# Altium schematic sheet MAZ000173 - Diagrama físico.SchDoc: MAZ000173 - Diagrama físico
size A; ApprovedBy: Christian Ledwidth; CheckedBy: Nahuel Martinez; Author: Santiago Marti; CompanyName: Body Health; DrawnBy: Santiago Marti; Revision: A; SheetNumber: 1; SheetTotal: 2
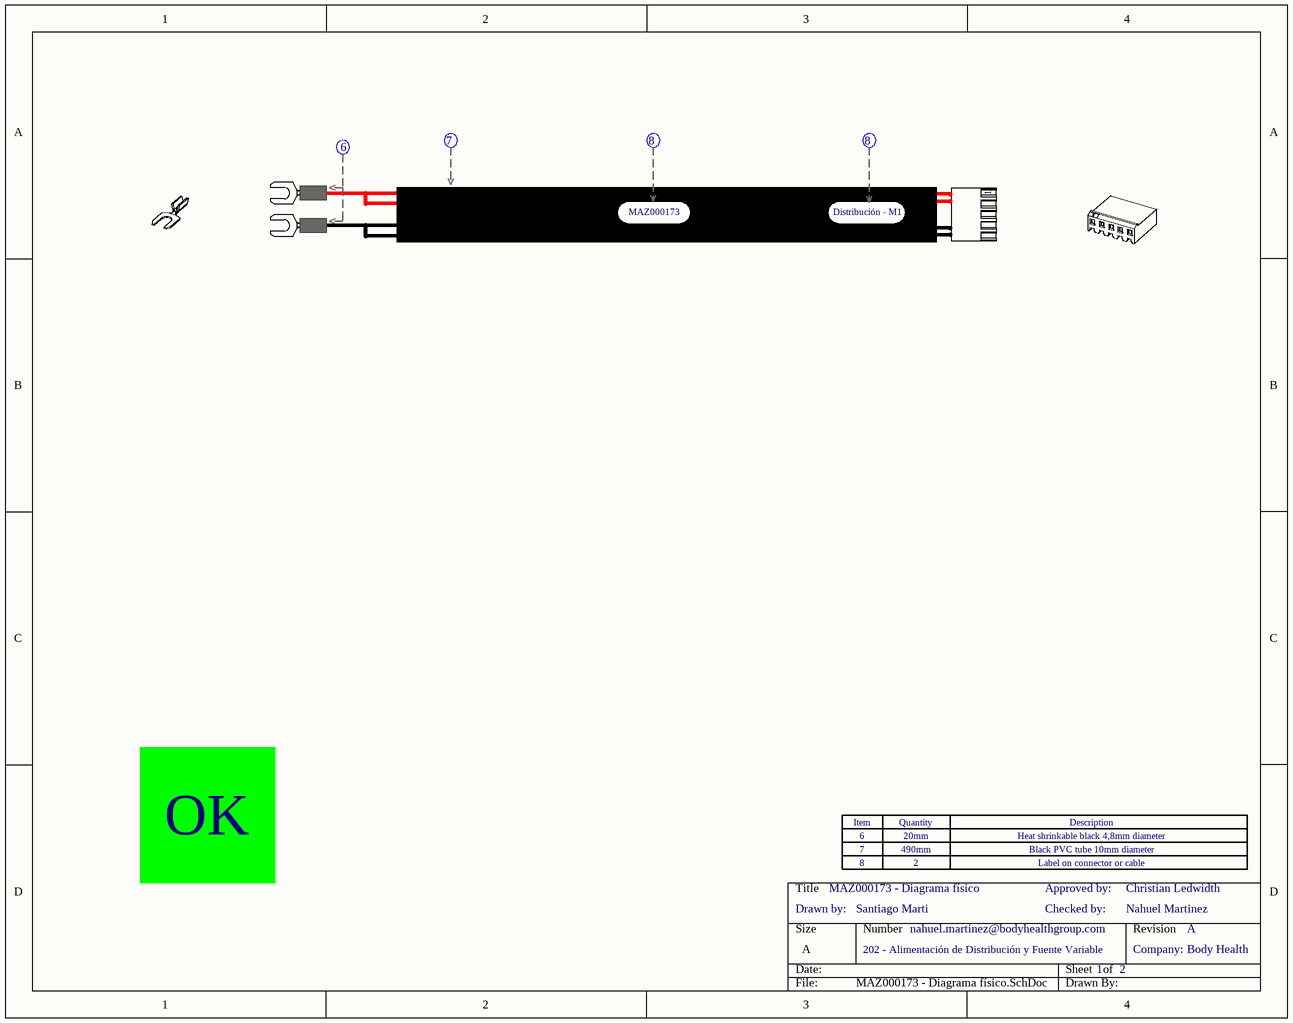
[diagram p0: MAZ000173 - Diagrama físico.SchDoc]

## Parts
(Parts that share a designator on the sheet are numbered #1, #2 ... from top to bottom, then left to right.)
Cab1  Cable  (value not drawn)
Cab2  Cable  (value not drawn)
Cab3  Cable  (value not drawn)
Con1  SL156-5  (value not drawn)  (parts A,B of 4)
Con?#1  Spade  (value not drawn)  (part A of 4)
Con?#2  Spade  (value not drawn)  (part B of 4)
Con?#3  Spade  (value not drawn)  (part A of 4)
Ter?  Termocontraible  (value not drawn)
Zoc?#1  Zócalo_Header  (value not drawn)
Zoc?#2  Zócalo_Item  (value not drawn)
Zoc?#3  Zócalo_Item  (value not drawn)
Zoc?#4  Zócalo_Item  (value not drawn)

## Notes on the sheet
- MAZ000173
- Distribución - M1
- OK
- (near Zoc?#1) 6
- 20mm
- Heat shrinkable black 4,8mm diameter
- (near Zoc?#4) Drawn by:
- (near Zoc?#2) 7
- (near Zoc?#3) 8
- 490mm
- 2
- Checked by:
- Approved by:
- Black PVC tube 10mm diameter
- Label on connector or cable
- 202 - Alimentación de Distribución y Fuente Variable
- nahuel.martinez@bodyhealthgroup.com
- Company:
- (in symbol Zócalo_Header) Item; Quantity; Description

## Library data of the parts
Cab1 = Cable: CallOut: 7; Largo: *mm; Sección: *mm2; Color: *
Cab2 Cab3 = Cable: CallOut: 8; Largo: *mm; Sección: *mm2; Color: *
Con1 = SL156-5: CONN RECEPT 5 POS W/RAMP SL-156; Cod.Fabricante: 640250-5; Fabricante: TE Connectivity AMP Connectors; Cod.DigiKey: A19953-ND; ComponentLink1Description: Manufacturer Link; ComponentLink1URL: https://www.te.com/commerce/DocumentDelivery/DDEController?Action=srchrtrv&DocNm=640250&DocType=Customer+Drawing&DocLang=English; DIGIKEYx50: 0.19420; CallOut: *; DIGIKEYx100: 0.18660
Con?#1-Con?#3 = Spade: CONN HOUSING SPADE M4; Cod.DigiKey: -; Cod.Fabricante: -; ComponentLink1Description: Manufacturer Link; ComponentLink1URL: -; DIGIKEYx50: -; Fabricante: -; CallOut: *; DIGIKEYx100: -
Ter? = Termocontraible: CallOut: 6; Largo: *; Diámetro: *
Zoc?#1 = Zócalo_Header: Header para el zócalo de referencias
Zoc?#2-Zoc?#4 = Zócalo_Item: Ítem para el zócalo de referencias; Desginator: *; Quantity: *; ItemDescription: *